# Altium schematic sheet ext_supplies.SchDoc
size 330 x 299 mm; SheetNumber: 13; SheetTotal: 13
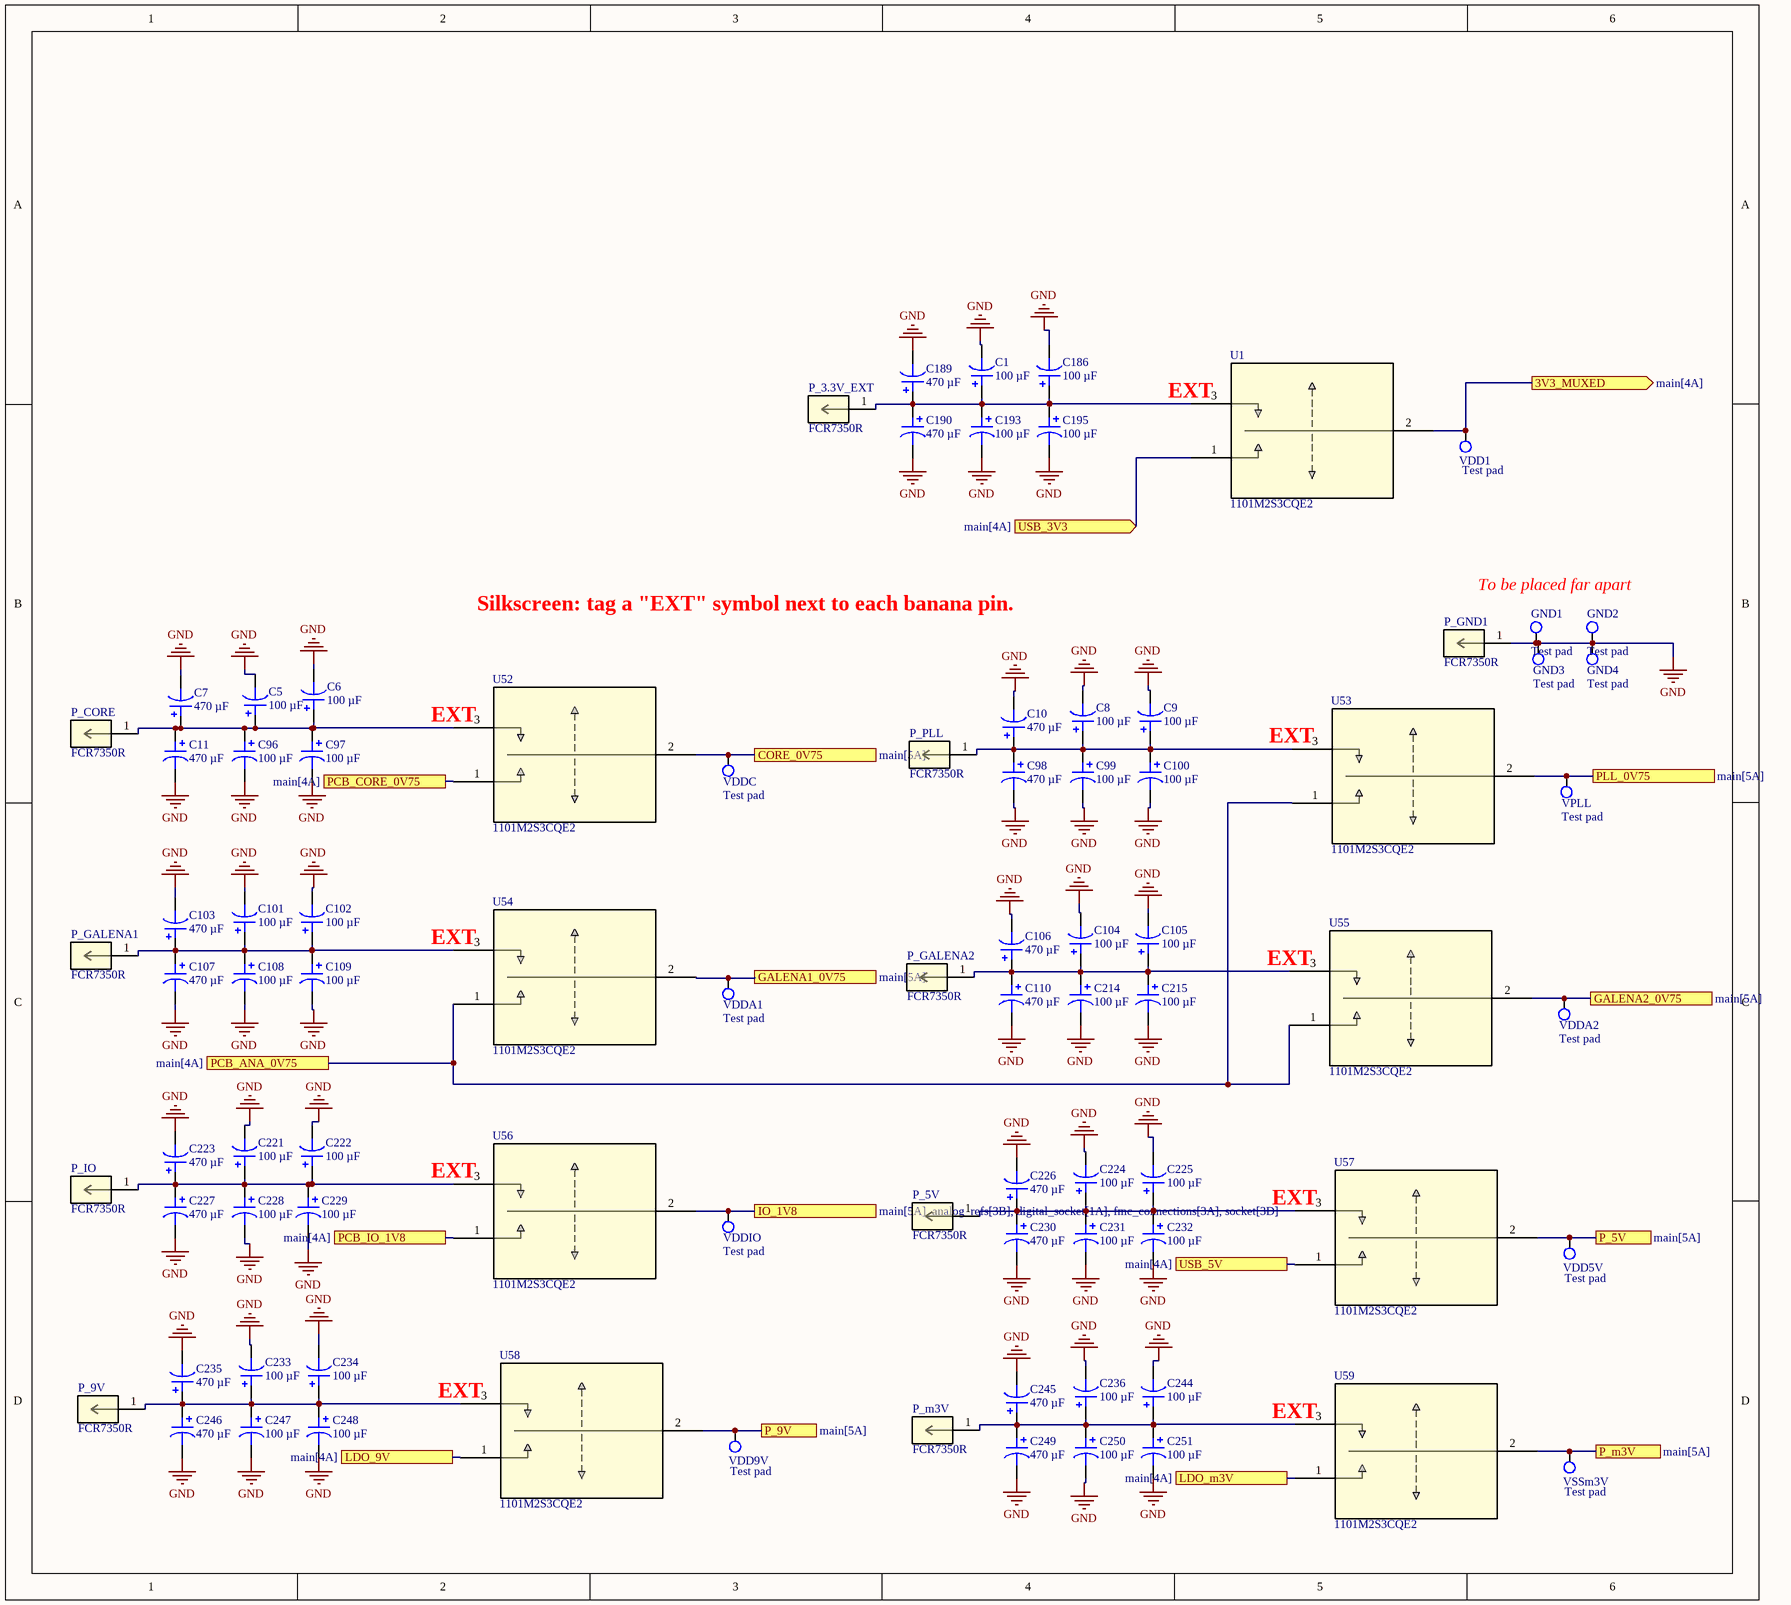
[diagram p0: ext_supplies.SchDoc]

## Parts
C1  100 µF  [CAP POL 1411_3528]
C5  100 µF  [CAP POL 1411_3528]
C6  100 µF  [CAP POL 1411_3528]
C7  470 µF  [CAP POL 2917_7343]
C8  100 µF  [CAP POL 1411_3528]
C9  100 µF  [CAP POL 1411_3528]
C10  470 µF  [CAP POL 2917_7343]
C11  470 µF  [CAP POL 2917_7343]
C96  100 µF  [CAP POL 1411_3528]
C97  100 µF  [CAP POL 1411_3528]
C98  470 µF  [CAP POL 2917_7343]
C99  100 µF  [CAP POL 1411_3528]
C100  100 µF  [CAP POL 1411_3528]
C101  100 µF  [CAP POL 1411_3528]
C102  100 µF  [CAP POL 1411_3528]
C103  470 µF  [CAP POL 2917_7343]
C104  100 µF  [CAP POL 1411_3528]
C105  100 µF  [CAP POL 1411_3528]
C106  470 µF  [CAP POL 2917_7343]
C107  470 µF  [CAP POL 2917_7343]
C108  100 µF  [CAP POL 1411_3528]
C109  100 µF  [CAP POL 1411_3528]
C110  470 µF  [CAP POL 2917_7343]
C186  100 µF  [CAP POL 1411_3528]
C189  470 µF  [CAP POL 2917_7343]
C190  470 µF  [CAP POL 2917_7343]
C193  100 µF  [CAP POL 1411_3528]
C195  100 µF  [CAP POL 1411_3528]
C214  100 µF  [CAP POL 1411_3528]
C215  100 µF  [CAP POL 1411_3528]
C221  100 µF  [CAP POL 1411_3528]
C222  100 µF  [CAP POL 1411_3528]
C223  470 µF  [CAP POL 2917_7343]
C224  100 µF  [CAP POL 1411_3528]
C225  100 µF  [CAP POL 1411_3528]
C226  470 µF  [CAP POL 2917_7343]
C227  470 µF  [CAP POL 2917_7343]
C228  100 µF  [CAP POL 1411_3528]
C229  100 µF  [CAP POL 1411_3528]
C230  470 µF  [CAP POL 2917_7343]
C231  100 µF  [CAP POL 1411_3528]
C232  100 µF  [CAP POL 1411_3528]
C233  100 µF  [CAP POL 1411_3528]
C234  100 µF  [CAP POL 1411_3528]
C235  470 µF  [CAP POL 2917_7343]
C236  100 µF  [CAP POL 1411_3528]
C244  100 µF  [CAP POL 1411_3528]
C245  470 µF  [CAP POL 2917_7343]
C246  470 µF  [CAP POL 2917_7343]
C247  100 µF  [CAP POL 1411_3528]
C248  100 µF  [CAP POL 1411_3528]
C249  470 µF  [CAP POL 2917_7343]
C250  100 µF  [CAP POL 1411_3528]
C251  100 µF  [CAP POL 1411_3528]
GND1  Test pad  [Test Pad]
GND2  Test pad  [Test Pad]
GND3  Test pad  [Test Pad]
GND4  Test pad  [Test Pad]
P_3.3V_EXT  FCR7350R  [CONN1_FCR7350R_CLF]
P_5V  FCR7350R  [CONN1_FCR7350R_CLF]
P_9V  FCR7350R  [CONN1_FCR7350R_CLF]
P_CORE  FCR7350R  [CONN1_FCR7350R_CLF]
P_GALENA1  FCR7350R  [CONN1_FCR7350R_CLF]
P_GALENA2  FCR7350R  [CONN1_FCR7350R_CLF]
P_GND1  FCR7350R  [CONN1_FCR7350R_CLF]
P_IO  FCR7350R  [CONN1_FCR7350R_CLF]
P_m3V  FCR7350R  [CONN1_FCR7350R_CLF]
P_PLL  FCR7350R  [CONN1_FCR7350R_CLF]
U1  1101M2S3CQE2  [1101M2S3CQE2]
U52  1101M2S3CQE2  [1101M2S3CQE2]
U53  1101M2S3CQE2  [1101M2S3CQE2]
U54  1101M2S3CQE2  [1101M2S3CQE2]
U55  1101M2S3CQE2  [1101M2S3CQE2]
U56  1101M2S3CQE2  [1101M2S3CQE2]
U57  1101M2S3CQE2  [1101M2S3CQE2]
U58  1101M2S3CQE2  [1101M2S3CQE2]
U59  1101M2S3CQE2  [1101M2S3CQE2]
VDD1  Test pad  [Test Pad]
VDD5V  Test pad  [Test Pad]
VDD9V  Test pad  [Test Pad]
VDDA1  Test pad  [Test Pad]
VDDA2  Test pad  [Test Pad]
VDDC  Test pad  [Test Pad]
VDDIO  Test pad  [Test Pad]
VPLL  Test pad  [Test Pad]
VSSm3V  Test pad  [Test Pad]

## Ports
3V3_MUXED (out, see main[4A]), CORE_0V75 (see main[5A]), GALENA1_0V75 (see main[5A]), GALENA2_0V75 (see main[5A]), IO_1V8 (see main[5A], analog_refs[3B], digital_socket[1A], fmc_connections[3A], socket[3D]), LDO_9V (see main[4A]), LDO_m3V (see main[4A]), P_5V (see main[5A]), P_9V (see main[5A]), P_m3V (see main[5A]), PCB_ANA_0V75 (see main[4A]), PCB_CORE_0V75 (see main[4A]), PCB_IO_1V8 (see main[4A]), PLL_0V75 (see main[5A]), USB_3V3 (in, see main[4A]), USB_5V (see main[4A])

## Nets
GND: C1.2 C5.2 C6.2 C7.2 C8.2 C9.2 C10.2 C11.2 C96.2 C97.2 C98.2 C99.2 C100.2 C101.2 C102.2 C103.2 C104.2 C105.2 C106.2 C107.2 C108.2 C109.2 C110.2 C186.2 C189.2 C190.2 C193.2 C195.2 C214.2 C215.2 C221.2 C222.2 C223.2 C224.2 C225.2 C226.2 C227.2 C228.2 C229.2 C230.2 C231.2 C232.2 C233.2 C234.2 C235.2 C236.2 C244.2 C245.2 C246.2 C247.2 C248.2 C249.2 C250.2 C251.2 GND1.1 GND2.1 GND3.1 GND4.1 P_GND1.1
3V3_MUXED: U1.2 VDD1.1 ; port 3V3_MUXED
CORE_0V75: U52.2 VDDC.1 ; port CORE_0V75
GALENA1_0V75: U54.2 VDDA1.1 ; port GALENA1_0V75
GALENA2_0V75: U55.2 VDDA2.1 ; port GALENA2_0V75
IO_1V8: U56.2 VDDIO.1 ; port IO_1V8
LDO_9V: U58.1 ; port LDO_9V
LDO_m3V: U59.1 ; port LDO_m3V
P_5V: U57.2 VDD5V.1 ; port P_5V
P_9V: U58.2 VDD9V.1 ; port P_9V
P_m3V: U59.2 VSSm3V.1 ; port P_m3V
PCB_ANA_0V75: U53.1 U54.1 U55.1 ; port PCB_ANA_0V75
PCB_CORE_0V75: U52.1 ; port PCB_CORE_0V75
PCB_IO_1V8: U56.1 ; port PCB_IO_1V8
PLL_0V75: U53.2 VPLL.1 ; port PLL_0V75
USB_3V3: U1.1 ; port USB_3V3
USB_5V: U57.1 ; port USB_5V
NetC1_1: C1.1 C186.1 C189.1 C190.1 C193.1 C195.1 P_3.3V_EXT.1 U1.3
NetC5_1: C5.1 C6.1 C7.1 C11.1 C96.1 C97.1 P_CORE.1 U52.3
NetC8_1: C8.1 C9.1 C10.1 C98.1 C99.1 C100.1 P_PLL.1 U53.3
NetC101_1: C101.1 C102.1 C103.1 C107.1 C108.1 C109.1 P_GALENA1.1 U54.3
NetC104_1: C104.1 C105.1 C106.1 C110.1 C214.1 C215.1 P_GALENA2.1 U55.3
NetC221_1: C221.1 C222.1 C223.1 C227.1 C228.1 C229.1 P_IO.1 U56.3
NetC224_1: C224.1 C225.1 C226.1 C230.1 C231.1 C232.1 P_5V.1 U57.3
NetC233_1: C233.1 C234.1 C235.1 C246.1 C247.1 C248.1 P_9V.1 U58.3
NetC236_1: C236.1 C244.1 C245.1 C249.1 C250.1 C251.1 P_m3V.1 U59.3

## Notes on the sheet
- (near U1) EXT
- Silkscreen: tag a "EXT" symbol next to each banana pin.
- To be placed far apart
- (near U52) EXT
- (near U53) EXT
- (near U54) EXT
- (near U55) EXT
- (near U56) EXT
- (near U57) EXT
- (near U58) EXT
- (near U59) EXT

## Library data of the parts
C1 C5 C6 C8 C9 C96 C97 C99-C102 C104 C105 C108 C109 C186 C193 C195 C214 C215 C221 C222 C224 C225 C228 C229 C231-C234 C236 C244 C247 C248 C250 C251 = 293D107X06R3B2TE3: CAP TANT 100UF 20% 6.3V 1411; manufacturer: Vishay Sprague; Manufacturer Size Code: B; ESR (Equivalent Series Resistance): 1.7Ohm; Type: Molded; Part Number: 293D107X06R3B2TE3; Value: 100 µF; Capacitance: 100 µF; componentlink1description: Datasheet; componentlink1url: http://www.vishay.com/docs/40002/293d.pdf; componentlink2description: DigiKey Link; componentlink2url: https://www.digikey.com/en/products/detail/vishay-sprague/293D107X06R3B2TE3/1578632; Device Package: 1411 (3528 Metric); Features: General Purpose; Height - Seated (Max): 0.083" (2.11mm); lastupdated: 4/5/2026 8:12:05 PM; Lifecycle Status: Active; Minimum Order: 1; Mounting Type: Surface Mount; Operating Temperature: -55°C ~ 125°C; Package / Case: 1411 (3528 Metric); packaging: TapeAndReel; partid: 1463; Part Status: Active; price: 0.14; series: TANTAMOUNT™, 293D; Size / Dimension: 0.138" L x 0.110" W (3.50mm x 2.80mm); Supplier 1: DigiKey; Supplier Part Number 1: 718-293D107X06R3B2TE3CT-ND; Tolerance: ±20%; Voltage - Rated: 6.3 V
C7 C10 C11 C98 C103 C106 C107 C110 C189 C190 C223 C226 C227 C230 C235 C245 C246 C249 = 293D477X0004D2TE3: CAP TANT 470UF 20% 4V 2917; manufacturer: Vishay Sprague; Manufacturer Size Code: D; ESR (Equivalent Series Resistance): 600mOhm; Type: Molded; Part Number: 293D477X0004D2TE3; Value: 470 µF; Capacitance: 470 µF; componentlink1description: Datasheet; componentlink1url: http://www.vishay.com/docs/40002/293d.pdf; componentlink2description: DigiKey Link; componentlink2url: https://www.digikey.com/en/products/detail/vishay-sprague/293D477X0004D2TE3/1578956; Device Package: 2917 (7343 Metric); Features: General Purpose; Height - Seated (Max): 0.122" (3.10mm); lastupdated: 4/5/2026 8:13:53 PM; Lifecycle Status: Active; Minimum Order: 1; Mounting Type: Surface Mount; Operating Temperature: -55°C ~ 125°C; Package / Case: 2917 (7343 Metric); packaging: TapeAndReel; partid: 2464; Part Status: Active; price: 0.81; series: TANTAMOUNT®, 293D; Size / Dimension: 0.287" L x 0.169" W (7.30mm x 4.30mm); Supplier 1: DigiKey; Supplier Part Number 1: 718-293D477X0004D2TE3CT-ND; Tolerance: ±20%; Voltage - Rated: 4 V
P_3.3V_EXT P_5V P_9V P_CORE P_GALENA1 P_GALENA2 P_GND1 P_IO P_m3V P_PLL = FCR7350R: Description; Manufacturer_Name: Cliff; Copyright: Copyright (C) 2026 Ultra Librarian. All rights reserved.; Manufacturer_Part_Number: FCR7350R; RefDes: RefDes; Type: Type
U1 U52-U59 = 1101M2S3CQE2: Description; Manufacturer_Name: C&K Components; Copyright: Copyright (C) 2025 Ultra Librarian. All rights reserved.; Manufacturer_Part_Number: 1101M2S3CQE2; RefDes: RefDes; Type: Type